# Altium schematic sheet MLX75023.SchDoc
size A
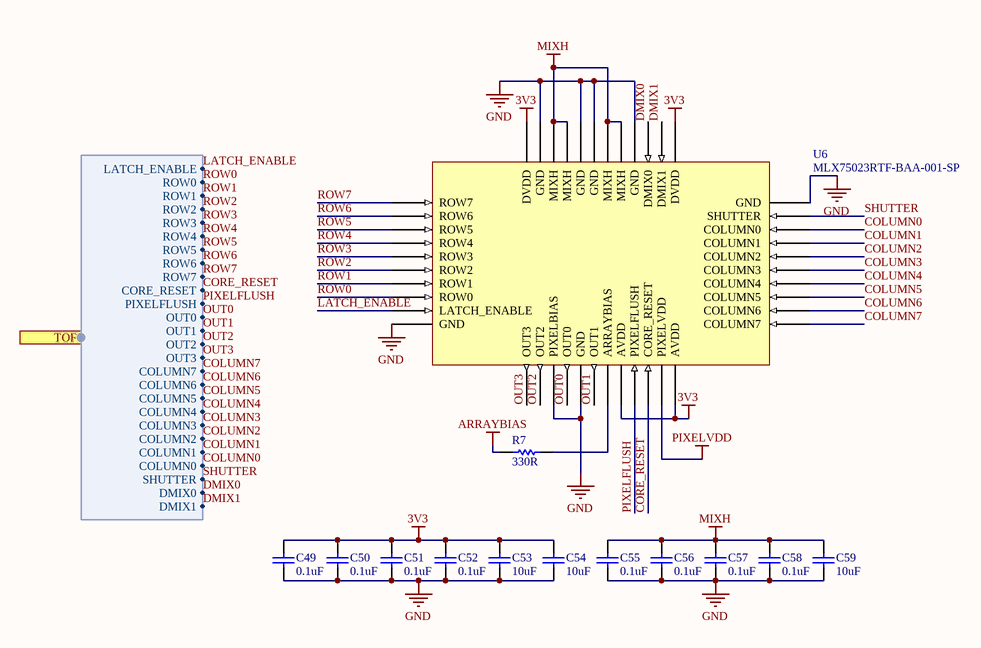
[diagram p0: MLX75023.SchDoc]

## Parts
C49  value 0.1uF  [C0402[1005X55]]  (hidden comment: 0.1uF 6.3V 0402)
C50  value 0.1uF  [C0402[1005X55]]  (hidden comment: 0.1uF 6.3V 0402)
C51  value 0.1uF  [C0402[1005X55]]  (hidden comment: 0.1uF 6.3V 0402)
C52  value 0.1uF  [C0402[1005X55]]  (hidden comment: 0.1uF 6.3V 0402)
C53  value 10uF  [C0402[1005X55]]  (hidden comment: 10uF 6.3V 0402)
C54  value 10uF  [C0402[1005X55]]  (hidden comment: 10uF 6.3V 0402)
C55  value 0.1uF  [C0402[1005X55]]  (hidden comment: 0.1uF 6.3V 0402)
C56  value 0.1uF  [C0402[1005X55]]  (hidden comment: 0.1uF 6.3V 0402)
C57  value 0.1uF  [C0402[1005X55]]  (hidden comment: 0.1uF 6.3V 0402)
C58  value 0.1uF  [C0402[1005X55]]  (hidden comment: 0.1uF 6.3V 0402)
C59  value 10uF  [C0402[1005X55]]  (hidden comment: 10uF 6.3V 0402)
R7  value 330R  [R0402[1005]]  (hidden comment: 330R 1% 0402)
U6  MLX75023RTF-BAA-001-SP  [BGA-44]

## Ports
TOF (harness TOF)

## Harnesses
TOF: DMIX1, DMIX0, SHUTTER, COLUMN0, COLUMN1, COLUMN2, COLUMN4, COLUMN3, COLUMN5, COLUMN6, COLUMN7, LATCH_ENABLE, ROW0, ROW1, ROW2, ROW3, ROW4, ROW5, ROW6, ROW7, CORE_RESET, PIXELFLUSH, OUT0, OUT1, OUT2, OUT3

## Nets
3V3: C49.2 C50.2 C51.2 C52.2 C53.2 C54.2 U6.18(AVDD) U6.22(AVDD) U6.33(DVDD) U6.44(DVDD)
ARRAYBIAS: R7.1
GND: C49.1 C50.1 C51.1 C52.1 C53.1 C54.1 C55.1 C56.1 C57.1 C58.1 C59.1 U6.10(GND) U6.13(PIXELBIAS) U6.15(GND) U6.32(GND) U6.36(GND) U6.39(GND) U6.40(GND) U6.43(GND)
MIXH: C55.2 C56.2 C57.2 C58.2 C59.2 U6.37(MIXH) U6.38(MIXH) U6.41(MIXH) U6.42(MIXH)
PIXELVDD: U6.21(PIXELVDD)
COLUMN0: U6.30(COLUMN0) ; port TOF.COLUMN0
COLUMN1: U6.29(COLUMN1) ; port TOF.COLUMN1
COLUMN2: U6.28(COLUMN2) ; port TOF.COLUMN2
COLUMN3: U6.27(COLUMN3) ; port TOF.COLUMN3
COLUMN4: U6.26(COLUMN4) ; port TOF.COLUMN4
COLUMN5: U6.25(COLUMN5) ; port TOF.COLUMN5
COLUMN6: U6.24(COLUMN6) ; port TOF.COLUMN6
COLUMN7: U6.23(COLUMN7) ; port TOF.COLUMN7
CORE_RESET: U6.20(CORE_RESET) ; port TOF.CORE_RESET
DMIX0: U6.35(DMIX0) ; port TOF.DMIX0
DMIX1: U6.34(DMIX1) ; port TOF.DMIX1
LATCH_ENABLE: U6.9(LATCH_ENABLE) ; port TOF.LATCH_ENABLE
OUT0: U6.14(OUT0) ; port TOF.OUT0
OUT1: U6.16(OUT1) ; port TOF.OUT1
OUT2: U6.12(OUT2) ; port TOF.OUT2
OUT3: U6.11(OUT3) ; port TOF.OUT3
PIXELFLUSH: U6.19(PIXELFLUSH) ; port TOF.PIXELFLUSH
ROW0: U6.8(ROW0) ; port TOF.ROW0
ROW1: U6.7(ROW1) ; port TOF.ROW1
ROW2: U6.6(ROW2) ; port TOF.ROW2
ROW3: U6.5(ROW3) ; port TOF.ROW3
ROW4: U6.4(ROW4) ; port TOF.ROW4
ROW5: U6.3(ROW5) ; port TOF.ROW5
ROW6: U6.2(ROW6) ; port TOF.ROW6
ROW7: U6.1(ROW7) ; port TOF.ROW7
SHUTTER: U6.31(SHUTTER) ; port TOF.SHUTTER
NetR7_2: R7.2 U6.17(ARRAYBIAS)

## Library data of the parts
C49-C52 C55-C58 = CAP_0.1uF_6.3V_0402_10%: 0.1uF 6.3V 10% 0402 (1005 Metric); PartNumber: GRM155R70J104KA01D; Manufacturer: Murata; Mounting Technology: Surface Mount; PackageReference: 0402; PackageDescription: 0402 (1005 Metric); Voltage: 6.3V; Tolerance: 10%
C53 C54 C59 = CAP_10uF_6.3V_0402_20%: 10uF 6.3V 20% 0402 (1005 Metric); PartNumber: GRM155R60J106ME44D; Manufacturer: Murata; Mounting Technology: Surface Mount; PackageReference: 0402; PackageDescription: 0402 (1005 Metric); Voltage: 6.3V; Tolerance: 20%
R7 = RES_330R_0402_1%_1: 330R 0.063W 1% 0402 (1005 Metric); Manufacturer: KOA Speer; PartNumber: RK73H1ETTP3300F; Tolerance: 1%; Power: 0.063W; Mounting Technology: Surface Mount; PackageReference: 0402; PackageDescription: 0402 (1005 Metric); ComponentLink1Description: Datasheet; ComponentLink1URL: http://www.koaspeer.com/catimages/Products/RK73H/RK73H.pdf
U6 = MLX75023RTF-BAA-001-SP: Manufacturer: Melexis; PartNumber: MLX75023RTF-BAA-001-SP; Mounting Technology: Surface Mount; PackageReference: BGA-44